# Altium schematic sheet tube.SchDoc
size A3; Hw_rev: R1; Address3: Firenze; Address4: ITALY; Revision: 0; SheetNumber: 4; SheetTotal: 4
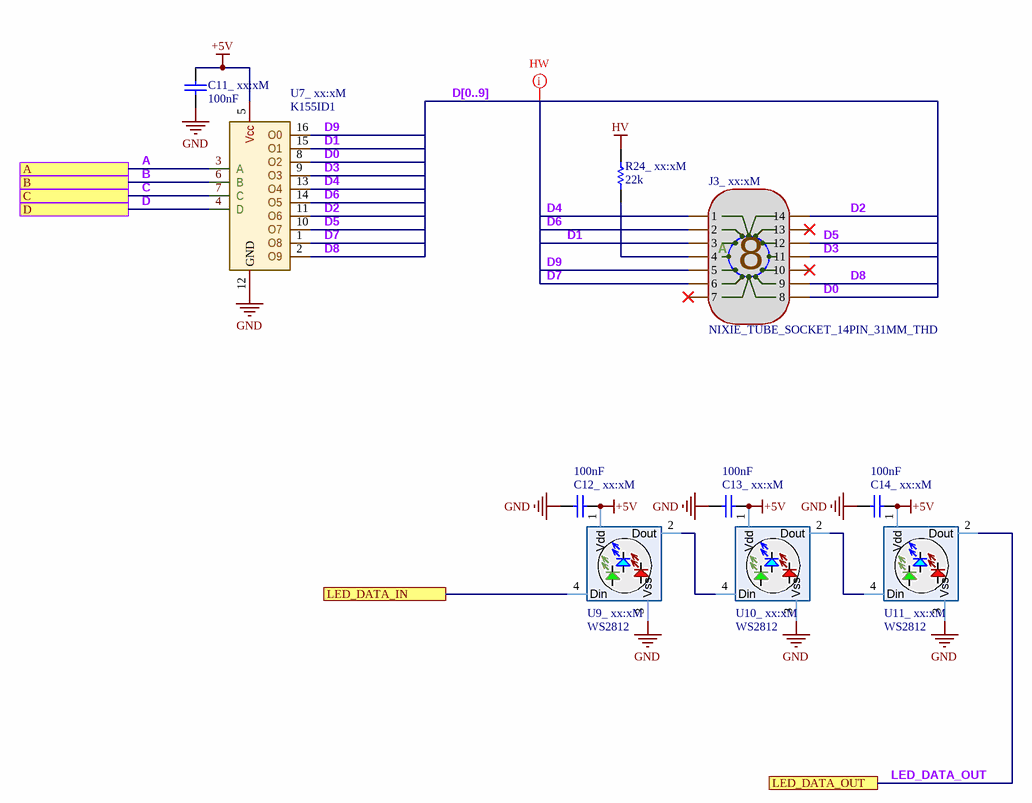
[diagram p0: tube.SchDoc]

## Parts
C11__xx:xM  100nF  [0603_[1608]]
C12__xx:xM  100nF  [0603_[1608]]
C13__xx:xM  100nF  [0603_[1608]]
C14__xx:xM  100nF  [0603_[1608]]
J3__xx:xM  NIXIE_TUBE_SOCKET_14PIN_31MM_THD  [SOCKET_NIXI_TUBE]  (no BOM)
R24__xx:xM  22k  [AXIAL 10mm]
U7__xx:xM  K155ID1  [DIP-16_THD]
U9__xx:xM  WS2812  [LED_PLCC_RGB_4P_1010]
U10__xx:xM  WS2812  [LED_PLCC_RGB_4P_1010]
U11__xx:xM  WS2812  [LED_PLCC_RGB_4P_1010]

## Ports
A, B, C, D, LED_DATA_IN, LED_DATA_OUT

## Nets
+5V: C11__xx:xM.2 C12__xx:xM.2 C13__xx:xM.2 C14__xx:xM.2 U7__xx:xM.5(Vcc) U9__xx:xM.1(Vdd) U10__xx:xM.1(Vdd) U11__xx:xM.1(Vdd)
GND: C11__xx:xM.1 C12__xx:xM.1 C13__xx:xM.1 C14__xx:xM.1 U7__xx:xM.12(GND) U9__xx:xM.3(Vss) U10__xx:xM.3(Vss) U11__xx:xM.3(Vss)
HV: R24__xx:xM.2
A: U7__xx:xM.3(A) ; port A
B: U7__xx:xM.6(B) ; port B
C: U7__xx:xM.7(C) ; port C
D: U7__xx:xM.4(D) ; port D
D0: J3__xx:xM.8 U7__xx:xM.8(O2)
D1: J3__xx:xM.3 U7__xx:xM.15(O1)
D2: J3__xx:xM.14 U7__xx:xM.11(O6)
D3: J3__xx:xM.11 U7__xx:xM.9(O3)
D4: J3__xx:xM.1 U7__xx:xM.13(O4)
D5: J3__xx:xM.12 U7__xx:xM.10(O7)
D6: J3__xx:xM.2 U7__xx:xM.14(O5)
D7: J3__xx:xM.6 U7__xx:xM.1(O8)
D8: J3__xx:xM.9 U7__xx:xM.2(O9)
D9: J3__xx:xM.5 U7__xx:xM.16(O0)
LED_DATA_IN: U9__xx:xM.4(Din) ; port LED_DATA_IN
LED_DATA_OUT: U11__xx:xM.2(Dout) ; port LED_DATA_OUT
NetJ3__xx:xM_4: J3__xx:xM.4 R24__xx:xM.1
NetU9__xx:xM_2: U9__xx:xM.2(Dout) U10__xx:xM.4(Din)
NetU10__xx:xM_2: U10__xx:xM.2(Dout) U11__xx:xM.4(Din)

Not connected (* = marked no-connect by the designer): J3__xx:xM 7* 10* 13*

## Buses and harness runs
bus D[0..9]

## Layout directives
net class HV: (no net found under the mark)

## Notes on the sheet
- Title:
- Project:
- Desc:
- Variant:
- File:
- License:
- asterix24@gmail.com
- Ing. Daniele Basile
- Rev:
- Prj Rev:
- Status:
- Size:
- Date:
- Time:
- Sheet
- of
- A3
- (in symbol CMP-057-000033-2) A

## Library data of the parts
C11__xx:xM C12__xx:xM C13__xx:xM C14__xx:xM = Cap: Capacitor; Value: 100nF; NOTE Manufacturer PN: *; NOTE Manufacturer: *; MountTechnology: *; CODE Develer: *; ComponentLink1Description: New link; ComponentLink1URL: *; NOTE Description: *; NOTE Description 2: *
J3__xx:xM = CMP-057-000033-2: Design Item ID: NIXIE_TUBE_SOCKET_14PIN_31MM_THD; NOTE Manufacturer: *; CODE Develer: *; NOTE Manufacturer PN: *; NOTE Description: *; NOTE Description 2: *; Publisher: Develer srl; Revision: 0.1; MountTechnology: SMT
R24__xx:xM = Res: Resistor; Publisher: Develer srl; Revision: 0.1; NOTE Manufacturer PN: *; NOTE Manufacturer: *; MountTechnology: SMT; CODE Develer: *; NOTE Description: *; NOTE Description 2: *
U7__xx:xM = K155ID1: Nixie Tube HV Driver; Publisher: Develer srl; Revision: 0.1; NOTE Manufacturer PN: *; NOTE Manufacturer: *; MountTechnology: SMT; CODE Develer: *; NOTE Description: *; NOTE Description 2: *
U9__xx:xM U10__xx:xM U11__xx:xM = WS2812: Adressable Led RGB 1wire; Publisher: Develer srl; Revision: 0.1; NOTE Manufacturer PN: *; NOTE Manufacturer: *; MountTechnology: SMT; CODE Develer: *; NOTE Description: *; NOTE Description 2: *; CODE LCSC: C5349953
  U9__xx:xM: Parameter 1: *